# Altium schematic sheet RJ45-2.SchDoc
size A4
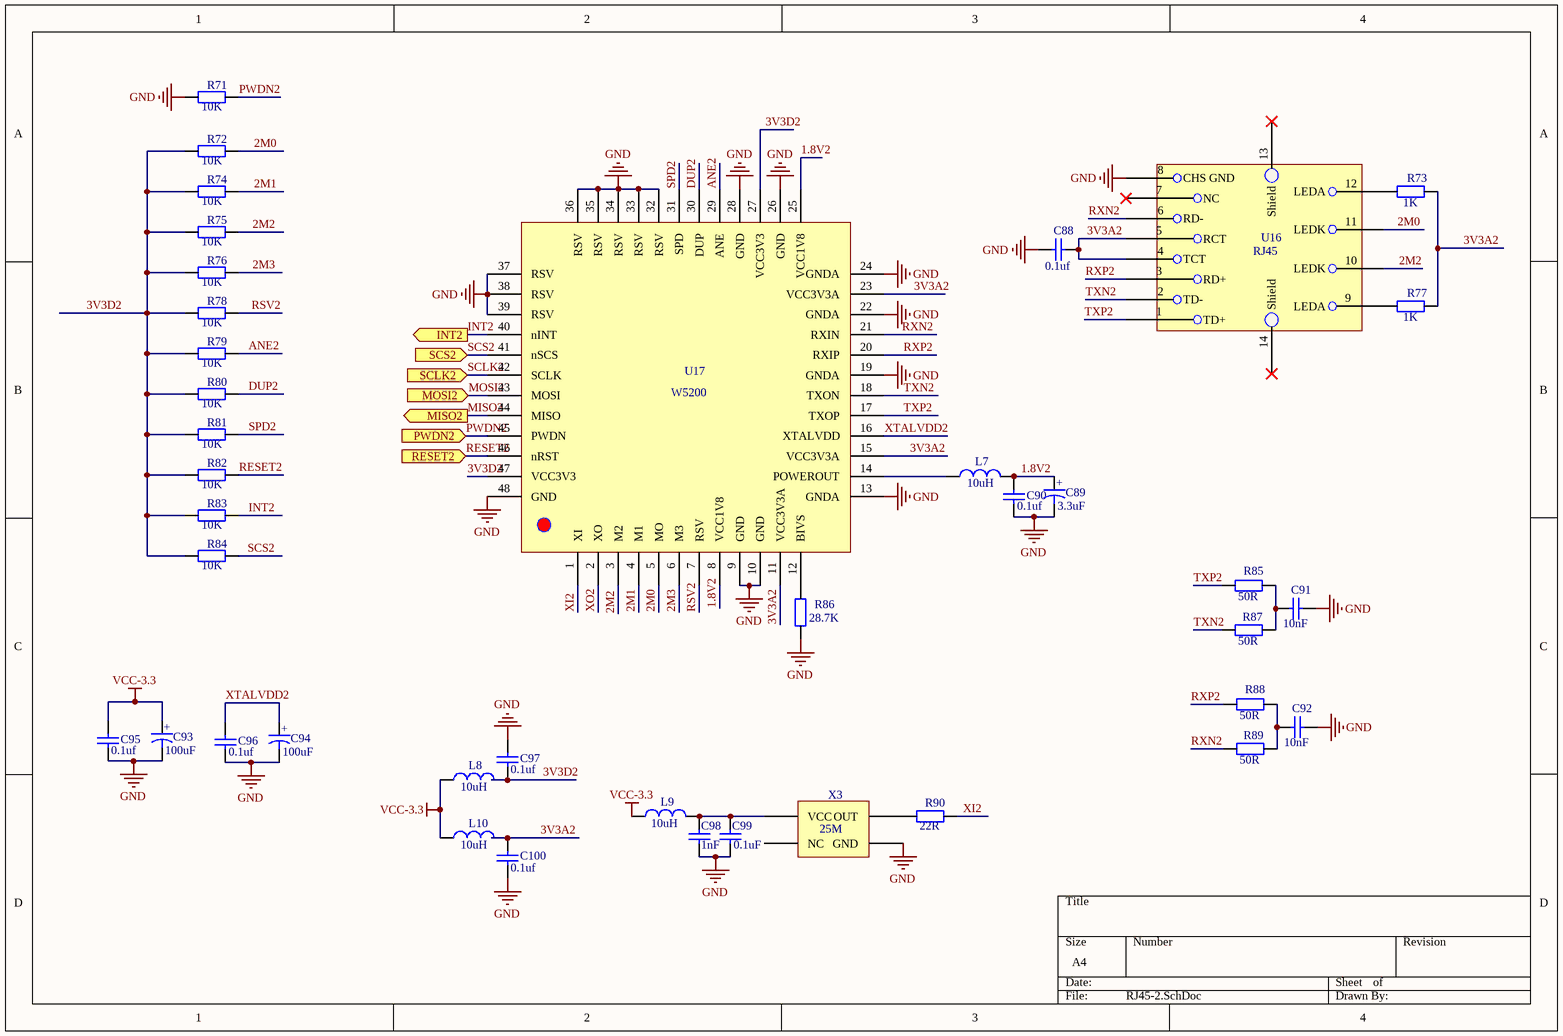
[diagram p0: RJ45-2.SchDoc]

## Parts
C88  value 0.1uf  [0603]  (hidden comment: Capacitor-0603)
C89  value 3.3uF  [钽电容1206（A3216）]  (hidden comment: 电解电容)
C90  value 0.1uf  [0603]  (hidden comment: Capacitor-0603)
C91  value 10nF  [0603]  (hidden comment: Capacitor-0603)
C92  value 10nF  [0603]  (hidden comment: Capacitor-0603)
C93  value 100uF  [钽电容1206（A3216）]  (hidden comment: 电解电容)
C94  value 100uF  [钽电容1206（A3216）]  (hidden comment: 电解电容)
C95  value 0.1uf  [0603]  (hidden comment: Capacitor-0603)
C96  value 0.1uf  [0603]  (hidden comment: Capacitor-0603)
C97  value 0.1uf  [0603]  (hidden comment: Capacitor-0603)
C98  value 1nF  [0603]  (hidden comment: Capacitor-0603)
C99  value 0.1uF  [0603]  (hidden comment: Capacitor-0603)
C100  value 0.1uf  [0603]  (hidden comment: Capacitor-0603)
L7  value 10uH  [0805]  (hidden comment: Inductor)
L8  value 10uH  [0805]  (hidden comment: Inductor)
L9  value 10uH  [0805]  (hidden comment: Inductor)
L10  value 10uH  [0805]  (hidden comment: Inductor)
R71  value 10K  [0603]  (hidden comment: Resistor-0603)
R72  value 10K  [0603]  (hidden comment: Resistor-0603)
R73  value 1K  [0603]  (hidden comment: Resistor-0603)
R74  value 10K  [0603]  (hidden comment: Resistor-0603)
R75  value 10K  [0603]  (hidden comment: Resistor-0603)
R76  value 10K  [0603]  (hidden comment: Resistor-0603)
R77  value 1K  [0603]  (hidden comment: Resistor-0603)
R78  value 10K  [0603]  (hidden comment: Resistor-0603)
R79  value 10K  [0603]  (hidden comment: Resistor-0603)
R80  value 10K  [0603]  (hidden comment: Resistor-0603)
R81  value 10K  [0603]  (hidden comment: Resistor-0603)
R82  value 10K  [0603]  (hidden comment: Resistor-0603)
R83  value 10K  [0603]  (hidden comment: Resistor-0603)
R84  value 10K  [0603]  (hidden comment: Resistor-0603)
R85  value 50R  [0603]  (hidden comment: Resistor-0603)
R86  value 28.7K  [0603]  (hidden comment: Resistor-0603)
R87  value 50R  [0603]  (hidden comment: Resistor-0603)
R88  value 50R  [0603]  (hidden comment: Resistor-0603)
R89  value 50R  [0603]  (hidden comment: Resistor-0603)
R90  value 22R  [0603]  (hidden comment: Resistor-0603)
U16  RJ45  [RJ45]
U17  Name: W5200  [W5200-Chip]  (hidden comment: W5200-Chip)
X3  value 25M  [有源晶振7050]  (hidden comment: 有源晶振)

## Ports
INT2 (out), MISO2 (out), MOSI2 (in), PWDN2 (in), RESET2 (in), SCLK2 (in), SCS2 (in)

## Nets
GND: C88.2 C89.1 C90.1 C91.2 C92.2 C93.1 C94.1 C95.1 C96.1 C97.2 C98.2 C99.2 C100.2 R71.1 R86.1 U16.8(CHS_GND) U17.9(GND) U17.10(GND) U17.13(GNDA) U17.19(GNDA) U17.22(GNDA) U17.24(GNDA) U17.26(GND) U17.28(GND) U17.32(RSV) U17.33(RSV) U17.34(RSV) U17.35(RSV) U17.36(RSV) U17.37(RSV) U17.38(RSV) U17.39(RSV) U17.48(GND) X3.2(GND)
VCC-3.3: C93.2 C95.2 L8.1 L9.1 L10.1
1.8V2: C89.2 C90.2 L7.2 U17.8(VCC1V8) U17.25(VCC1V8)
2M0: R72.2 U16.11(LEDK) U17.5(MO)
2M1: R74.2 U17.4(M1)
2M2: R75.2 U16.10(LEDK) U17.3(M2)
2M3: R76.2 U17.6(M3)
3V3A2: C88.1 C100.1 L10.2 R73.2 R77.2 U16.4(TCT) U16.5(RCT) U17.11(VCC3V3A) U17.15(VCC3V3A) U17.23(VCC3V3A)
3V3D2: C97.1 L8.2 R72.1 R74.1 R75.1 R76.1 R78.1 R79.1 R80.1 R81.1 R82.1 R83.1 R84.1 U17.27(VCC3V3) U17.47(VCC3V3)
ANE2: R79.2 U17.29(ANE)
DUP2: R80.2 U17.30(DUP)
INT2: R83.2 U17.40(nINT) ; port INT2
MISO2: U17.44(MISO) ; port MISO2
MOSI2: U17.43(MOSI) ; port MOSI2
PWDN2: R71.2 U17.45(PWDN) ; port PWDN2
RESET2: R82.2 U17.46(nRST) ; port RESET2
RSV2: R78.2 U17.7(RSV)
RXN2: R89.1 U16.6(RD-) U17.21(RXIN)
RXP2: R88.1 U16.3(RD+) U17.20(RXIP)
SCLK2: U17.42(SCLK) ; port SCLK2
SCS2: R84.2 U17.41(nSCS) ; port SCS2
SPD2: R81.2 U17.31(SPD)
TXN2: R87.1 U16.2(TD-) U17.18(TXON)
TXP2: R85.1 U16.1(TD+) U17.17(TXOP)
XI2: R90.2 U17.1(XI)
XO2: U17.2(XO)
XTALVDD2: C94.2 C96.2 U17.16(XTALVDD)
NetC91_1: C91.1 R85.2 R87.2
NetC92_1: C92.1 R88.2 R89.2
NetC98_1: C98.1 C99.1 L9.2 X3.4(VCC)
NetL7_1: L7.1 U17.14(POWEROUT)
NetR73_1: R73.1 U16.12(LEDA)
NetR77_1: R77.1 U16.9(LEDA)
NetR86_2: R86.2 U17.12(BIVS)
NetR90_1: R90.1 X3.3(OUT)

Not connected (* = marked no-connect by the designer): U16 7(NC)* 13(Shield)* 14(Shield)*; X3 1(NC)

## Notes on the sheet
- (in symbol 电解电容) +

## Library data of the parts
U16 = RJ45: Name: RJ45